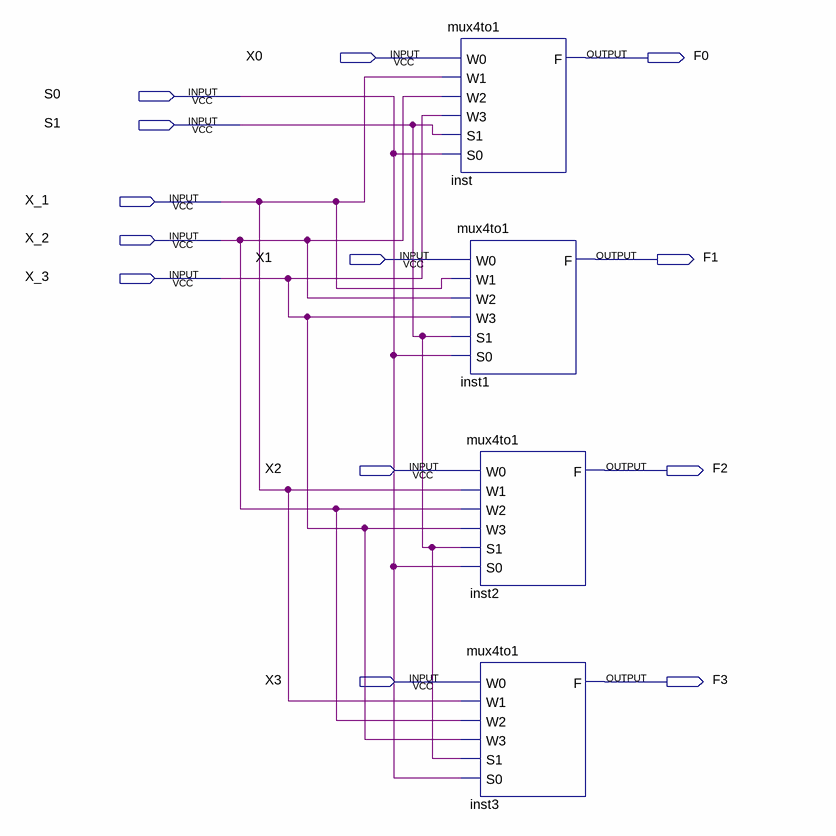
[diagram p0: schematic sheet]
// Quartus schematic lab8step2.bdf as structural Verilog: 4 symbols, 13 pins
module lab8step2 (
  input  X0,
  input  S0,
  input  S1,
  input  X_1,
  input  X_2,
  input  X1,
  input  X_3,
  input  X2,
  input  X3,
  output F0,
  output F1,
  output F2,
  output F3
);

  mux4to1 inst (.W0(X0), .W1(X_1), .W2(X_2), .W3(X_3), .S1(S1), .S0(S0), .F(F0));
  mux4to1 inst1 (.W0(X1), .W1(X_1), .W2(X_2), .W3(X_3), .S1(S1), .S0(S0), .F(F1));
  mux4to1 inst2 (.W0(X2), .W1(X_1), .W2(X_2), .W3(X_3), .S1(S1), .S0(S0), .F(F2));
  mux4to1 inst3 (.W0(X3), .W1(X_1), .W2(X_2), .W3(X_3), .S1(S1), .S0(S0), .F(F3));
endmodule
